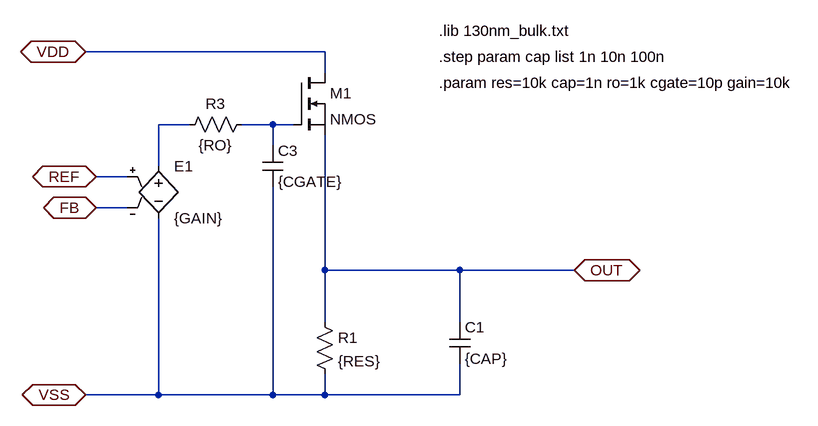
[diagram p0: schematic fake_current_src.asc]
fake_current_src.asc, the LTspice schematic file:
Version 4
SHEET 1 880 680
WIRE 0 -176 -368 -176
WIRE 0 -144 0 -176
WIRE -208 -64 -256 -64
WIRE -80 -64 -128 -64
WIRE -48 -64 -80 -64
WIRE -80 -32 -80 -64
WIRE -256 0 -256 -64
WIRE -304 16 -352 16
WIRE -304 64 -352 64
WIRE 0 160 0 -48
WIRE 208 160 0 160
WIRE 384 160 208 160
WIRE 0 240 0 160
WIRE 208 240 208 160
WIRE -256 352 -256 80
WIRE -256 352 -368 352
WIRE -80 352 -80 32
WIRE -80 352 -256 352
WIRE 0 352 0 320
WIRE 0 352 -80 352
WIRE 208 352 208 304
WIRE 208 352 0 352
FLAG 384 160 OUT
IOPIN 384 160 BiDir
FLAG -368 -176 VDD
IOPIN -368 -176 BiDir
FLAG -352 16 REF
IOPIN -352 16 BiDir
FLAG -352 64 FB
IOPIN -352 64 BiDir
FLAG -368 352 VSS
IOPIN -368 352 BiDir
SYMBOL e -256 -16 R0
SYMATTR InstName E1
SYMATTR Value {GAIN}
SYMBOL res -16 224 R0
SYMATTR InstName R1
SYMATTR Value {RES}
SYMBOL cap 192 240 R0
SYMATTR InstName C1
SYMATTR Value {CAP}
SYMBOL nmos -48 -144 R0
SYMATTR InstName M1
SYMBOL res -112 -80 R90
WINDOW 0 0 56 VBottom 2
WINDOW 3 32 56 VTop 2
SYMATTR InstName R3
SYMATTR Value {RO}
SYMBOL cap -96 -32 R0
SYMATTR InstName C3
SYMATTR Value {CGATE}
TEXT 176 -208 Left 2 !.lib 130nm_bulk.txt
TEXT 176 -128 Left 2 !.param res=10k cap=1n ro=1k cgate=10p gain=10k
TEXT 176 -168 Left 2 !.step param cap list 1n 10n 100n

The netlist it stands for:
* fake_current_src.asc
E1 N001 VSS REF FB {GAIN}
R1 OUT VSS {RES}
C1 OUT VSS {CAP}
M1 VDD N002 OUT OUT NMOS
R3 N002 N001 {RO}
C3 N002 VSS {CGATE}
.model NMOS NMOS
.model PMOS PMOS
.lib standard.mos
.lib 130nm_bulk.txt
.param res=10k cap=1n ro=1k cgate=10p gain=10k
.step param cap list 1n 10n 100n
.backanno
.end